# Altium schematic sheet WWOL_phy.SchDoc
size A4; SheetNumber: 2; SheetTotal: 2
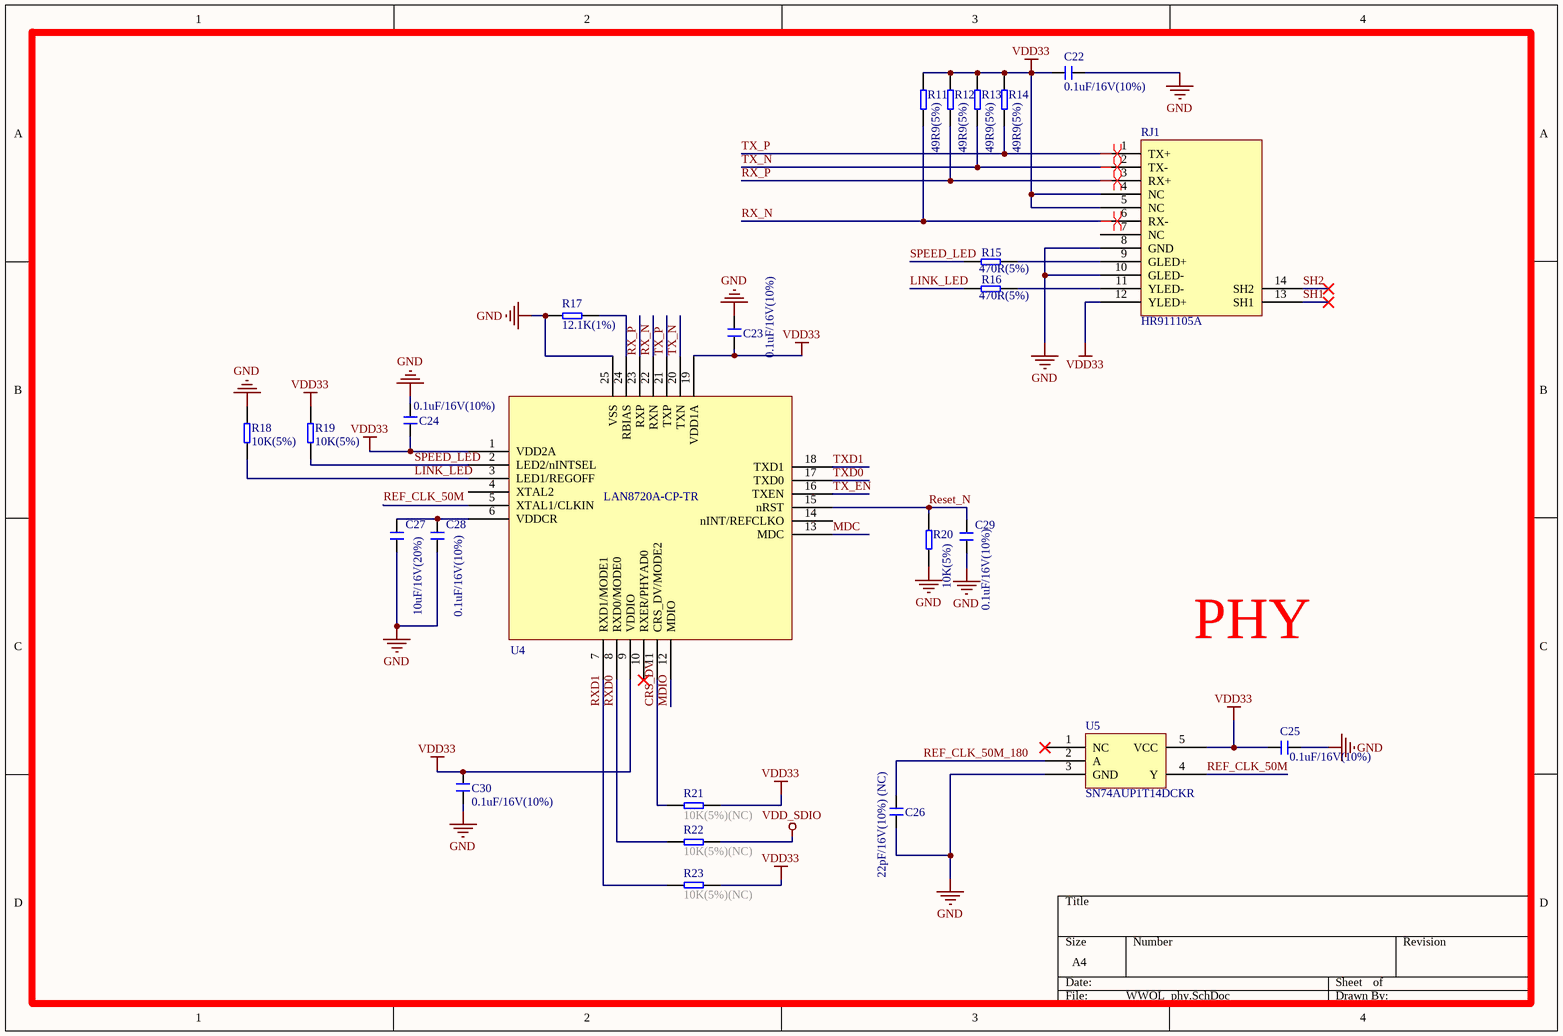
[diagram p0: WWOL_phy.SchDoc]

## Parts
C22  0.1uF/16V(10%)  [C0402]
C23  0.1uF/16V(10%)  [C0402]
C24  0.1uF/16V(10%)  [C0402]
C25  0.1uF/16V(10%)  [C0402]
C26  22pF/16V(10%) (NC)  [C0402]
C27  10uF/16V(20%)  [C0402]
C28  0.1uF/16V(10%)  [C0402]
C29  0.1uF/16V(10%)  [C0402]
C30  0.1uF/16V(10%)  [C0402]
R11  49R9(5%)  [R0402]
R12  49R9(5%)  [R0402]
R13  49R9(5%)  [R0402]
R14  49R9(5%)  [R0402]
R15  470R(5%)  [R0402]
R16  470R(5%)  [R0402]
R17  12.1K(1%)  [R0402]
R18  10K(5%)  [R0402]
R19  10K(5%)  [R0402]
R20  10K(5%)  [R0402]
R21  10K(5%)(NC)  [R0402]
R22  10K(5%)(NC)  [R0402]
R23  10K(5%)(NC)  [R0402]
RJ1  HR911105A  [RJ-45A12]
U4  LAN8720A-CP-TR  [QFN50P400X400X100_HS-25N]
U5  SN74AUP1T14DCKR  [SC-70-5_L2.1-W1.3-P0.65-LS2.1-BR]

## Nets
GND: C22.2 C23.2 C24.1 C25.1 C26.2 C27.1 C28.1 C29.1 C30.1 R17.2 R18.1 R20.1 RJ1.8(GND) RJ1.10(GLED-) U4.25(VSS) U5.3(GND)
VDD33: C22.1 C23.1 C24.2 C25.2 C30.2 R11.1 R12.1 R13.1 R14.1 R19.1 R21.2 R23.2 RJ1.4(NC) RJ1.5(NC) RJ1.12(YLED+) U4.1(VDD2A) U4.9(VDDIO) U4.19(VDD1A) U5.5(VCC)
VDD_SDIO: R22.2
CRS_DV: R21.1 U4.11(CRS_DV/MODE2)
LINK_LED: R16.2 R18.2 U4.3(LED1/REGOFF)
MDC: U4.13(MDC)
MDIO: U4.12(MDIO)
REF_CLK_50M: U4.5(XTAL1/CLKIN) U5.4(Y)
REF_CLK_50M_180: C26.1 U5.2(A)
Reset_N: C29.2 R20.2 U4.15(nRST)
RX_N: R11.2 RJ1.6(RX-) U4.22(RXN)
RX_P: R12.2 RJ1.3(RX+) U4.23(RXP)
RXD0: R22.1 U4.8(RXD0/MODE0)
RXD1: R23.1 U4.7(RXD1/MODE1)
SH1: RJ1.13(SH1)
SH2: RJ1.14(SH2)
SPEED_LED: R15.2 R19.2 U4.2(LED2/nINTSEL)
TX_EN: U4.16(TXEN)
TX_N: R13.2 RJ1.2(TX-) U4.20(TXN)
TX_P: R14.2 RJ1.1(TX+) U4.21(TXP)
TXD0: U4.17(TXD0)
TXD1: U4.18(TXD1)
NetC27_2: C27.2 C28.2 U4.6(VDDCR)
NetR15_1: R15.1 RJ1.9(GLED+)
NetR16_1: R16.1 RJ1.11(YLED-)
NetR17_1: R17.1 U4.24(RBIAS)

Not connected (* = marked no-connect by the designer): RJ1 7(NC); U4 4(XTAL2) 10(RXER/PHYAD0)* 14(nINT/REFCLKO); U5 1(NC)*

## Layout directives
differential pair: RX_N, RX_P, TX_N, TX_P

## Notes on the sheet
- PHY

## Library data of the parts
C22-C30 = C: 无极性贴片电容; 版权归属: 源创客; BOM名称: 无极性贴片电容; 学习资源: www.ooocke.com
R11-R23 = R: 贴片电阻
RJ1 = HR911105A: 带灯以太网接口
U4 = LAN8720A-CP-TR: 以太网phy
U5 = SN74AUP1T14DCKR: 反相器